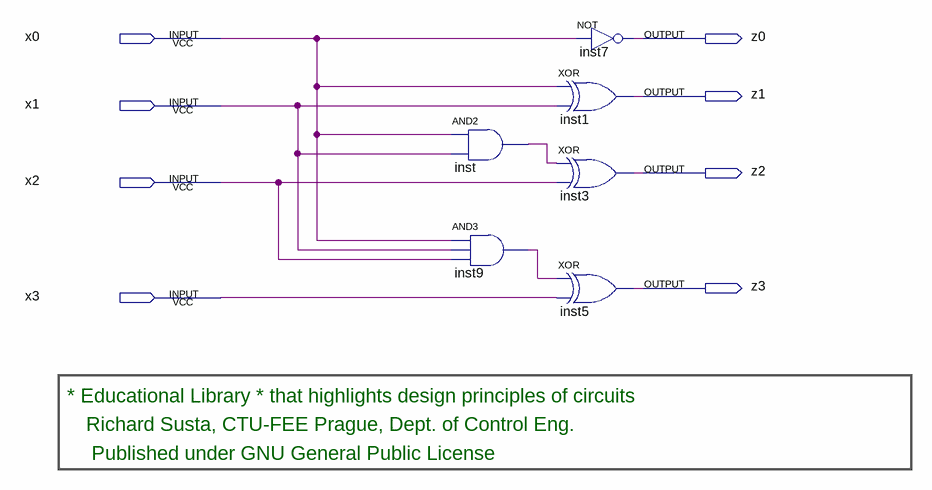
[diagram p0: schematic sheet]
// Quartus schematic add1_4bits.bdf as structural Verilog: 6 symbols, 8 pins
module add1_4bits (
  input  x0,
  input  x1,
  input  x2,
  input  x3,
  output z0,
  output z1,
  output z2,
  output z3
);

  wire inst9_out, inst_out;

  and inst (inst_out, x0, x1);
  and inst9 (inst9_out, x0, x1, x2);
  not inst7 (z0, x0);
  xor inst1 (z1, x0, x1);
  xor inst3 (z2, inst_out, x2);
  xor inst5 (z3, inst9_out, x3);

  // Notes on the sheet:
  //   * Educational Library * that highlights design principles of circuits
  //   Richard Susta, CTU-FEE Prague, Dept. of Control Eng. 
  //    Published under GNU General Public License
endmodule
